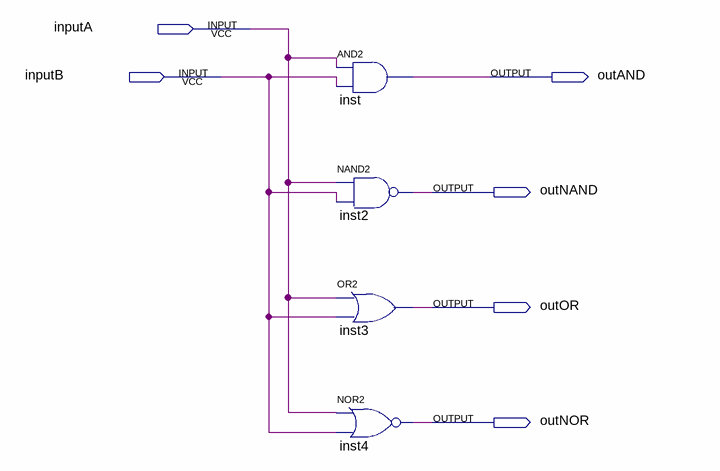
[diagram p0: schematic sheet]
// Quartus schematic Lab2.bdf as structural Verilog: 4 symbols, 6 pins
module Lab2 (
  input  inputA,
  input  inputB,
  output outAND,
  output outNAND,
  output outOR,
  output outNOR
);

  and inst (outAND, inputA, inputB);
  nand inst2 (outNAND, inputA, inputB);
  or inst3 (outOR, inputA, inputB);
  nor inst4 (outNOR, inputA, inputB);
endmodule
